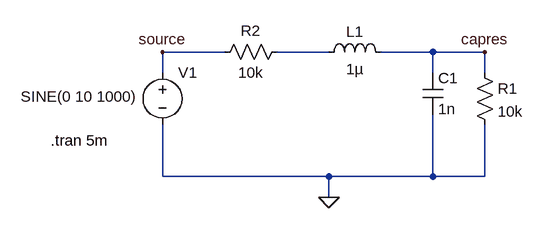
[diagram p0: schematic Circuit 1.asc]
Circuit 1.asc, the LTspice schematic file:
Version 4
SHEET 1 880 680
WIRE 160 96 64 96
WIRE 320 96 240 96
WIRE 480 96 400 96
WIRE 560 96 480 96
WIRE 64 128 64 96
WIRE 480 128 480 96
WIRE 560 128 560 96
WIRE 64 288 64 208
WIRE 320 288 64 288
WIRE 480 288 480 192
WIRE 480 288 320 288
WIRE 560 288 560 208
WIRE 560 288 480 288
WIRE 320 320 320 288
FLAG 320 320 0
FLAG 64 96 source
FLAG 560 96 capres
SYMBOL voltage 64 112 R0
WINDOW 3 -218 53 Left 2
WINDOW 123 0 0 Left 2
WINDOW 39 0 0 Left 2
SYMATTR InstName V1
SYMATTR Value SINE(0 10 1000)
SYMBOL res 544 112 R0
SYMATTR InstName R1
SYMATTR Value 10k
SYMBOL res 144 112 R270
WINDOW 0 33 56 VTop 2
WINDOW 3 0 56 VBottom 2
SYMATTR InstName R2
SYMATTR Value 10k
SYMBOL cap 464 128 R0
SYMATTR InstName C1
SYMATTR Value 1n
SYMBOL ind 304 112 R270
WINDOW 0 32 56 VTop 2
WINDOW 3 5 56 VBottom 2
SYMATTR InstName L1
SYMATTR Value 1µ
TEXT -108 232 Left 2 !.tran 5m

The netlist it stands for:
* Circuit 1.asc
V1 source 0 SINE(0 10 1000)
R1 capres 0 10k
R2 source N001 10k
C1 capres 0 1n
L1 N001 capres 1µ
.tran 5m
.backanno
.end